# EAGLE design wearable (EAGLE 9.3.2)
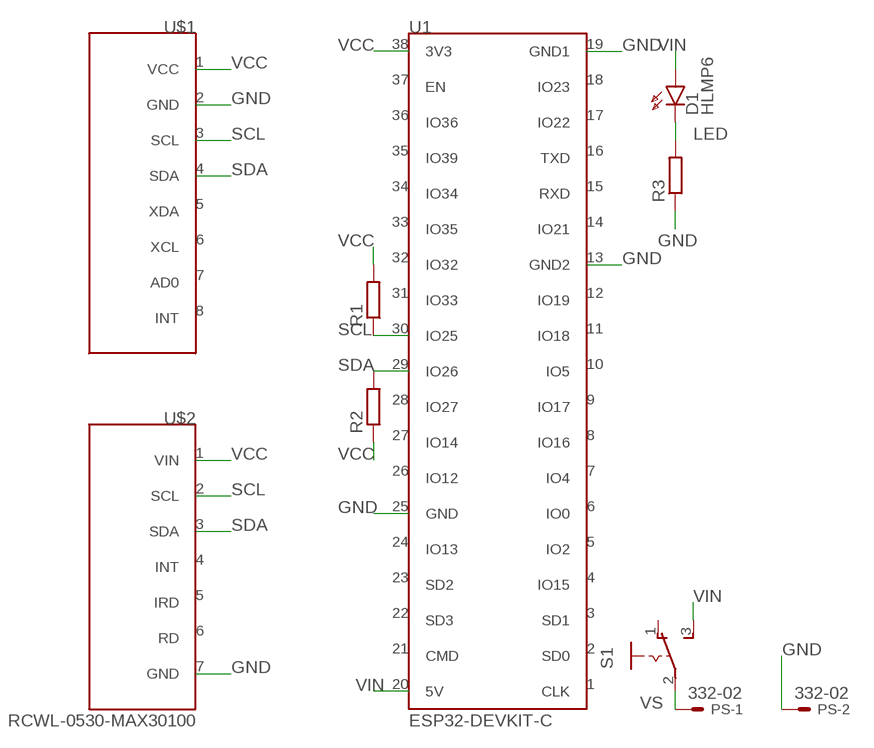
[diagram p0: schematic, sheet 1]

## Parts
D1  HLMP6  [HLMP6]
PS  332-02  [332-02]
R1  R-EU_0207/10  [0207/10]
R2  R-EU_0207/10  [0207/10]
R3  R-EU_0207/10  [0207/10]
S1  255SB  [255SB]
U1  ESP32-DEVKIT-C  [ESP32]
U$1  GY-521-MPU-6050  [GY-521]
U$2  RCWL-0530-MAX30100  [RCWL-0530]

## Nets
GND: PS.2 R3.1 U1.13(GND2) U1.19(GND1) U1.25(GND) U$1.2(GND) U$2.7(GND)
LED: D1.K R3.2
SCL: R1.1 U1.30(IO25) U$1.3(SCL) U$2.2(SCL)
SDA: R2.2 U1.29(IO26) U$1.4(SDA) U$2.3(SDA)
VCC: R1.2 R2.1 U1.38(3V3) U$1.1(VCC) U$2.1(VIN)
VIN: D1.A S1.3(S) U1.20(5V)
VS: PS.1 S1.2(P)
Unconnected: S1.1(O) U1.1(CLK) U1.2(SD0) U1.3(SD1) U1.4(IO15) U1.5(IO2) U1.6(IO0) U1.7(IO4) U1.8(IO16) U1.9(IO17) U1.10(IO5) U1.11(IO18) U1.12(IO19) U1.14(IO21) U1.15(RXD) U1.16(TXD) U1.17(IO22) U1.18(IO23) U1.21(CMD) U1.22(SD3) U1.23(SD2) U1.24(IO13) U1.26(IO12) U1.27(IO14) U1.28(IO27) U1.31(IO33) U1.32(IO32) U1.33(IO35) U1.34(IO34) U1.35(IO39) U1.36(IO36) U1.37(EN) U$1.5(XDA) U$1.6(XCL) U$1.7(AD0) U$1.8(INT) U$2.4(INT) U$2.5(IRD) U$2.6(RD)

## Library data of the parts
D1 = display-hp:HLMP6: LED 2mm horizontal; MF: AGILENT TECHNOLOGIES; MPN: HLMP-6500; OC_FARNELL: 1652490; OC_NEWARK: 40K0088
PS = con-garry:332-02: 2 Pin - 2mm Dual Row Source: www.mpe-connector.de / garry_shortform_2012.pdf
R1-R3 = rcl:R-EU_: RESISTOR, European symbol; SPICEPREFIX: R
S1 = switch:255SB: SLIDING SWITCH Distributor Buerklin, 11G810
U1 = esp-wroom-32:ESP32-DEVKIT-C
U$1 = esp-wroom-32:GY-521-MPU-6050
U$2 = esp-wroom-32:RCWL-0530-MAX30100

## Board
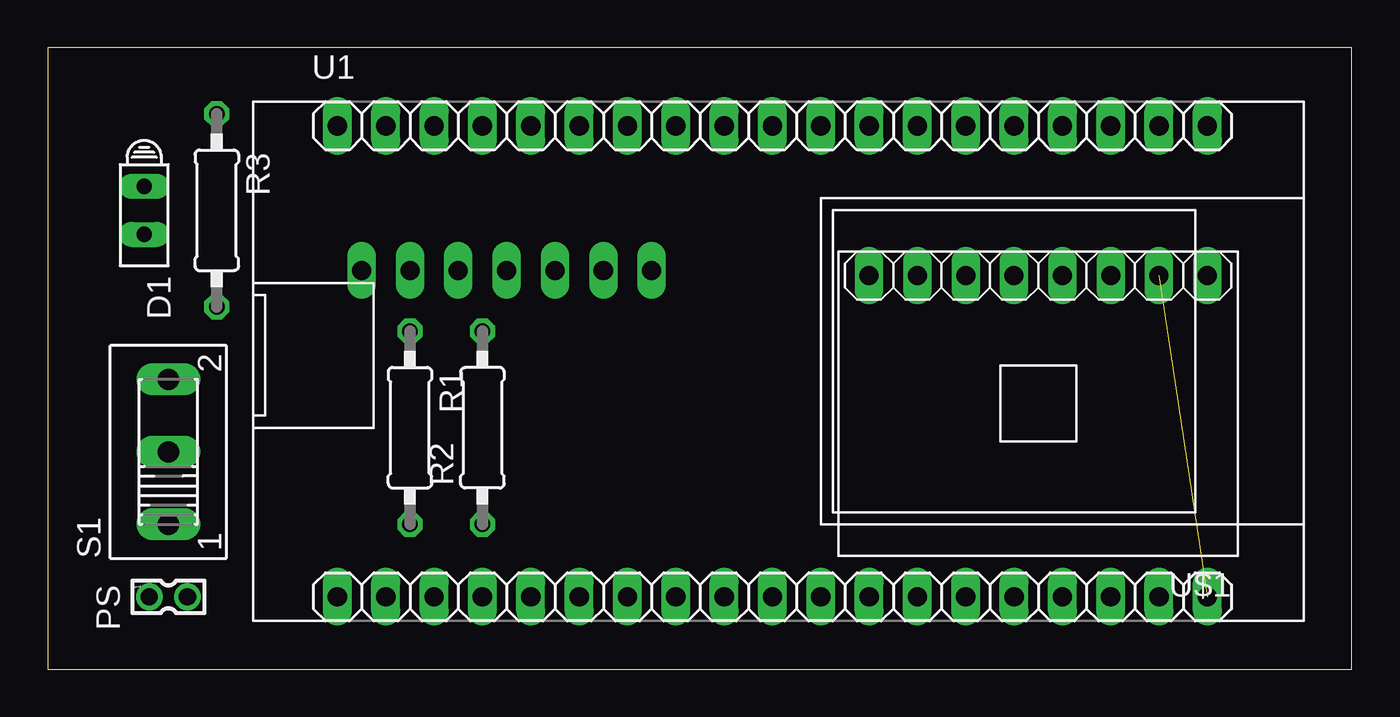
[diagram p1: board, top side]
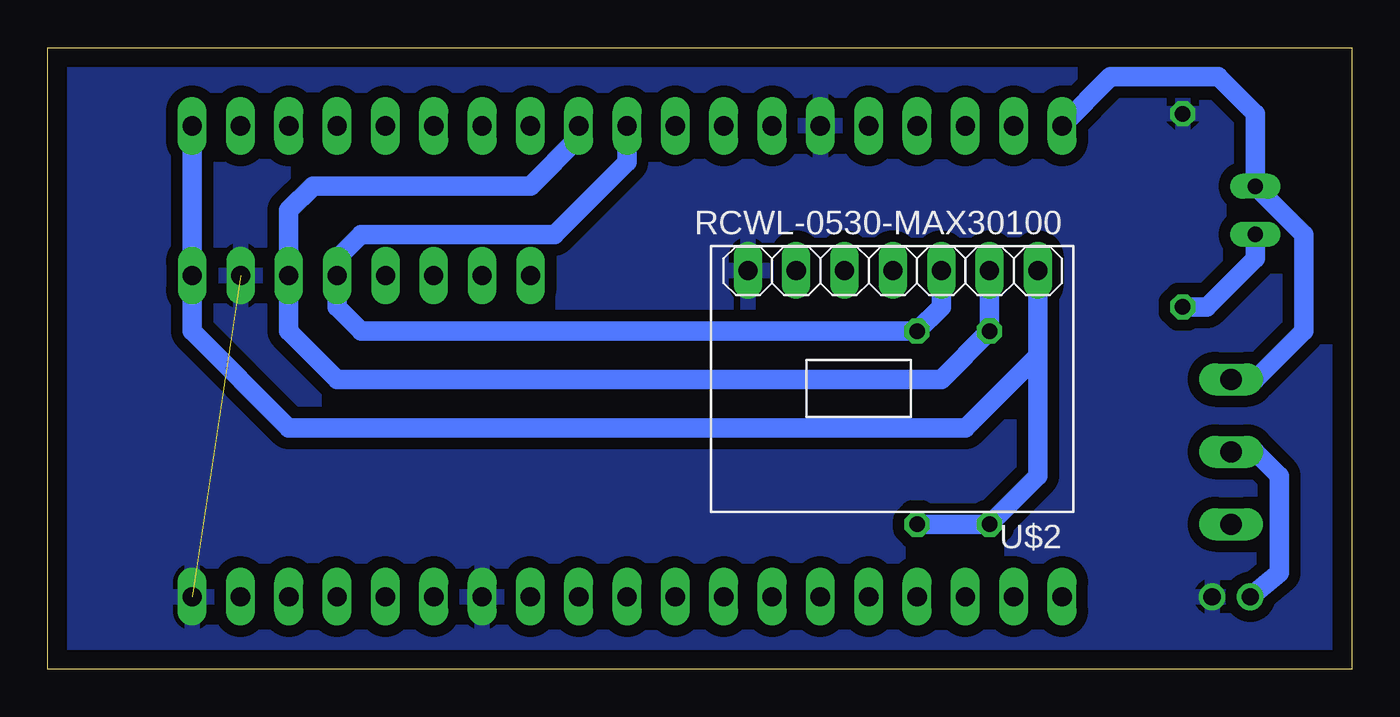
[diagram p2: board, bottom side, seen from below]

Size 68.56 x 32.69 mm. Coordinates in mm from the lower left corner, seen from the top.
Outline: 0,0 68.56,0 68.56,32.69 0,32.69 0,0
Copper layers (1*16): Top 0.035mm / dielectric 1.5mm / Bottom 0.035mm
Design rules "default": minimum track width 6mil, minimum drill 0.35mm, track to track 6mil, track to pad 6mil, pad to pad 6mil, via to via 6mil, smd to smd 6mil, copper to edge 40mil, drill to drill 6mil, minimum pad ring 10mil, minimum via ring 8mil, stop-mask expansion 4mil, vias tented up to drill 0mil, thermal gap 10mil

### Footprints (pad centres in the part's own frame; a part is rotated, then mirrored left to right if it is on the bottom)
HLMP6 = drill 0.813 long: A -1.27,0; K 1.27,0
332-02 = drill 0.9 pad 1.27: 1 0,-1; 2 0,1
0207/10 = drill 0.813 octagon: 1 -5.08,0; 2 5.08,0
255SB = drill 1.118 long: 1 -3.81,0; 2 0,0; 3 3.81,0
ESP32 = drill 1.016 long: 1 -22.86,0; 2 -20.32,0; 3 -17.78,0; 4 -15.24,0; 5 -12.7,0; 6 -10.16,0; 7 -7.62,0; 8 -5.08,0; 9 -2.54,0; 10 0,0; 11 2.54,0; 12 5.08,0; 13 7.62,0; 14 10.16,0; 15 12.7,0; 16 15.24,0; 17 17.78,0; 18 20.32,0; 19 22.86,0; 20 -22.86,24.765; 21 -20.32,24.765; 22 -17.78,24.765; 23 -15.24,24.765; 24 -12.7,24.765; 25 -10.16,24.765; 26 -7.62,24.765; 27 -5.08,24.765; 28 -2.54,24.765; 29 0,24.765; 30 2.54,24.765; 31 5.08,24.765; 32 7.62,24.765; 33 10.16,24.765; 34 12.7,24.765; 35 15.24,24.765; 36 17.78,24.765; 37 20.32,24.765; 38 22.86,24.765
GY-521 = drill 1 long: 1 -8.89,-6.73; 2 -6.35,-6.73; 3 -3.81,-6.73; 4 -1.27,-6.73; 5 1.27,-6.73; 6 3.81,-6.73; 7 6.35,-6.73; 8 8.89,-6.73
RCWL-0530 = drill 1 long: 1 -7.62,-5.73; 2 -5.08,-5.73; 3 -2.54,-5.73; 4 0,-5.73; 5 2.54,-5.73; 6 5.08,-5.73; 7 7.62,-5.73

### Placement (x,y rotation side)
D1  5.08,24.13 270 top
PS  6.35,3.81 270 top
R1  19.05,12.7 270 top
R2  22.86,12.7 90 top
R3  8.89,24.13 270 top
S1  6.35,11.43 90 top
U1  38.1,3.81 0 top
U$1  52.07,13.97 180 top
U$2  24.13,15.24 180 bottom

### Tracks (layer width: path | path; a pad name or v marks a point on that pad's centre or on a via)
GND  (1 unrouted)
  pour Bottom (isolate 0.61): 0,33.02 68.58,33.02 68.58,0 0,0
LED
  Bottom 1.016: D1.K 5.08,21.59 7.62,19.05 R3.2
SCL
  Bottom 1.016: U1.30 40.64,27.94 43.18,25.4 54.61,25.4 55.88,24.13 U$1.3 55.88,17.78 53.34,15.24 21.59,15.24 R1.1 U$2.2
SDA
  Bottom 1.016: U$2.3 21.59,19.05 R2.2 52.07,17.78 53.34,19.05 U$1.4 53.34,21.59 52.07,22.86 51.39,22.86 51.39,22.87 42.59,22.87 | 42.59,22.86 42.59,22.87 | U1.29 38.1,26.67 41.9,22.87 42.59,22.87
VCC
  Bottom 1.016: U$2.1 16.51,16.51 | 16.51,16.51 20.32,12.7 55.88,12.7 60.96,17.78 U$1.1 U1.38 | R2.1 R1.2 16.51,10.16 16.51,16.51
VIN
  Bottom 1.016: U1.20 12.7,31.17 7.04,31.17 5.08,29.21 D1.A 2.54,22.86 2.54,17.78 5.08,15.24 S1.3
VS
  Bottom 1.016: PS.1 3.81,5.08 3.81,10.16 5.08,11.43 S1.2